# Altium schematic sheet 7_FPGA_Power_Supply.SchDoc
size A4; Organization: SpaceLab UFSC; Address1: UFSC - SpaceLab; Address2: University Campus - Trindade; Address3: Dep. of Electrical Engineering - CTC; Address4: Florianópolis, Santa Catarina, Brazil; Address5: CEP: 88040 - 900
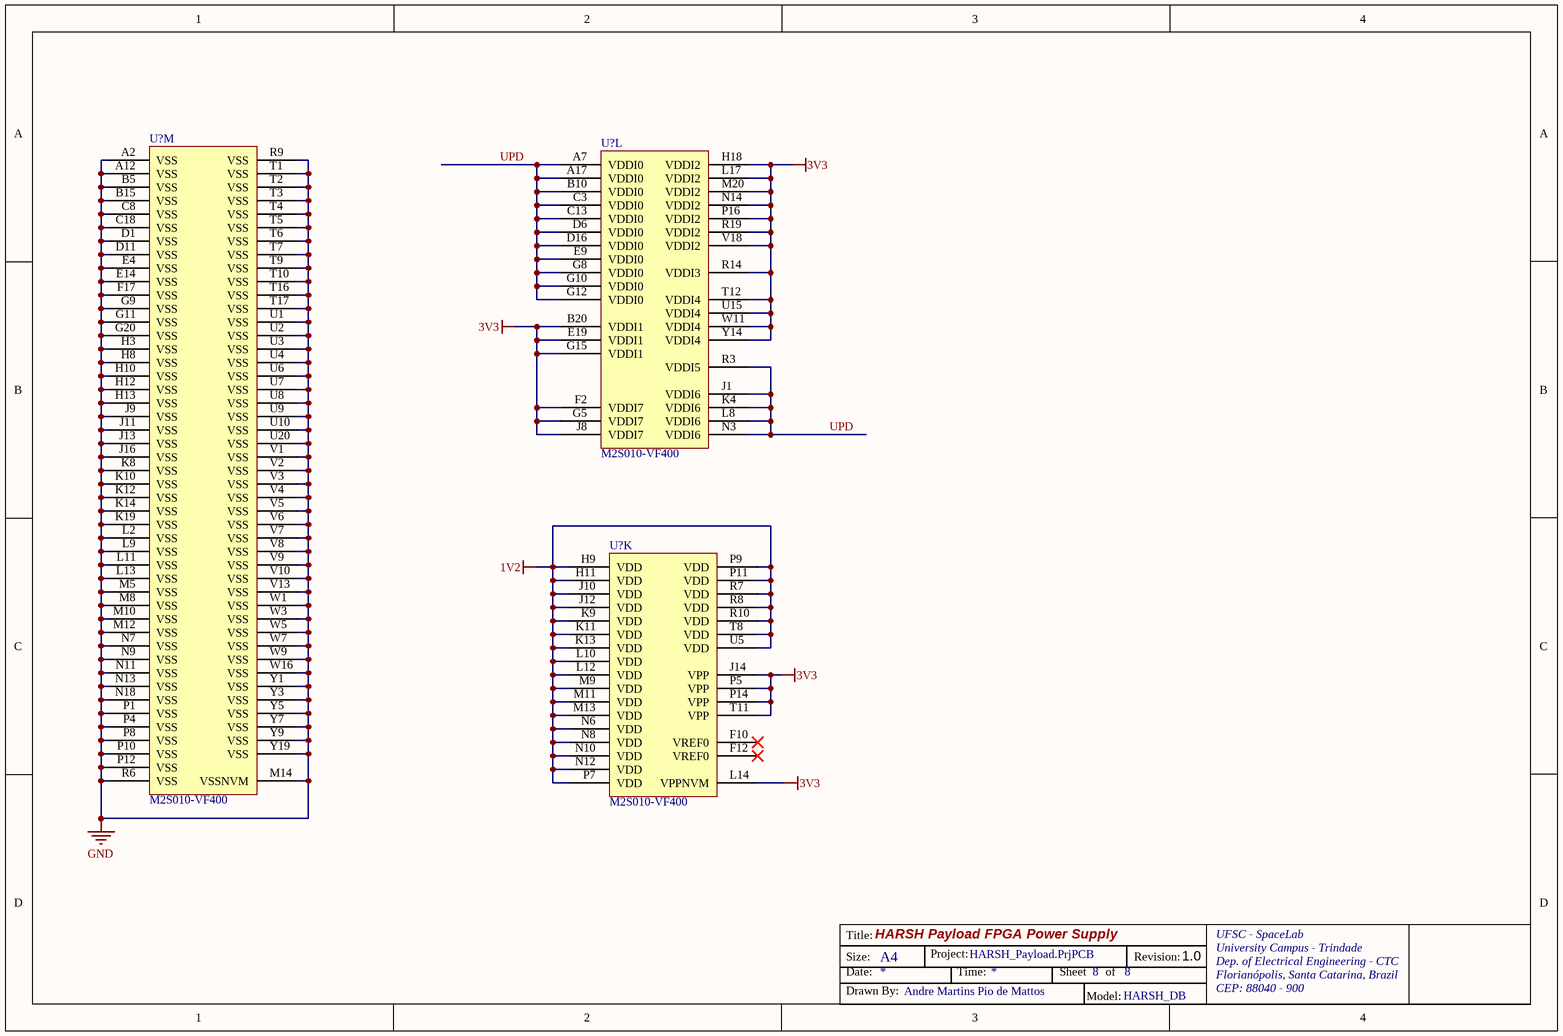
[diagram p0: 7_FPGA_Power_Supply.SchDoc]

## Parts
(Parts that share a designator on the sheet are numbered #1, #2 ... from top to bottom, then left to right.)
U?#1  M2S010-VF400  [MCSM-VF-400]  (part M of 14)
U?#2  M2S010-VF400  [MCSM-VF-400]  (part L of 14)
U?#3  M2S010-VF400  [MCSM-VF-400]  (part K of 14)

## Nets
1V2: U?#3.H9(VDD) U?#3.H11(VDD) U?#3.J10(VDD) U?#3.J12(VDD) U?#3.K9(VDD) U?#3.K11(VDD) U?#3.K13(VDD) U?#3.L10(VDD) U?#3.L12(VDD) U?#3.M9(VDD) U?#3.M11(VDD) U?#3.M13(VDD) U?#3.N6(VDD) U?#3.N8(VDD) U?#3.N10(VDD) U?#3.N12(VDD) U?#3.P7(VDD) U?#3.P9(VDD) U?#3.P11(VDD) U?#3.R7(VDD) U?#3.R8(VDD) U?#3.R10(VDD) U?#3.T8(VDD) U?#3.U5(VDD)
3V3: U?#2.B20(VDDI1) U?#2.E19(VDDI1) U?#2.F2(VDDI7) U?#2.G5(VDDI7) U?#2.G15(VDDI1) U?#2.H18(VDDI2) U?#2.J8(VDDI7) U?#2.L17(VDDI2) U?#2.M20(VDDI2) U?#2.N14(VDDI2) U?#2.P16(VDDI2) U?#2.R14(VDDI3) U?#2.R19(VDDI2) U?#2.T12(VDDI4) U?#2.U15(VDDI4) U?#2.V18(VDDI2) U?#2.W11(VDDI4) U?#2.Y14(VDDI4) U?#3.J14(VPP) U?#3.L14(VPPNVM) U?#3.P5(VPP) U?#3.P14(VPP) U?#3.T11(VPP)
GND: U?#1.A2(VSS) U?#1.A12(VSS) U?#1.B5(VSS) U?#1.B15(VSS) U?#1.C8(VSS) U?#1.C18(VSS) U?#1.D1(VSS) U?#1.D11(VSS) U?#1.E4(VSS) U?#1.E14(VSS) U?#1.F17(VSS) U?#1.G9(VSS) U?#1.G11(VSS) U?#1.G20(VSS) U?#1.H3(VSS) U?#1.H8(VSS) U?#1.H10(VSS) U?#1.H12(VSS) U?#1.H13(VSS) U?#1.J9(VSS) U?#1.J11(VSS) U?#1.J13(VSS) U?#1.J16(VSS) U?#1.K8(VSS) U?#1.K10(VSS) U?#1.K12(VSS) U?#1.K14(VSS) U?#1.K19(VSS) U?#1.L2(VSS) U?#1.L9(VSS) U?#1.L11(VSS) U?#1.L13(VSS) U?#1.M5(VSS) U?#1.M8(VSS) U?#1.M10(VSS) U?#1.M12(VSS) U?#1.M14(VSSNVM) U?#1.N7(VSS) U?#1.N9(VSS) U?#1.N11(VSS) U?#1.N13(VSS) U?#1.N18(VSS) U?#1.P1(VSS) U?#1.P4(VSS) U?#1.P8(VSS) U?#1.P10(VSS) U?#1.P12(VSS) U?#1.R6(VSS) U?#1.R9(VSS) U?#1.T1(VSS) U?#1.T2(VSS) U?#1.T3(VSS) U?#1.T4(VSS) U?#1.T5(VSS) U?#1.T6(VSS) U?#1.T7(VSS) U?#1.T9(VSS) U?#1.T10(VSS) U?#1.T16(VSS) U?#1.T17(VSS) U?#1.U1(VSS) U?#1.U2(VSS) U?#1.U3(VSS) U?#1.U4(VSS) U?#1.U6(VSS) U?#1.U7(VSS) U?#1.U8(VSS) U?#1.U9(VSS) U?#1.U10(VSS) U?#1.U20(VSS) U?#1.V1(VSS) U?#1.V2(VSS) U?#1.V3(VSS) U?#1.V4(VSS) U?#1.V5(VSS) U?#1.V6(VSS) U?#1.V7(VSS) U?#1.V8(VSS) U?#1.V9(VSS) U?#1.V10(VSS) U?#1.V13(VSS) U?#1.W1(VSS) U?#1.W3(VSS) U?#1.W5(VSS) U?#1.W7(VSS) U?#1.W9(VSS) U?#1.W16(VSS) U?#1.Y1(VSS) U?#1.Y3(VSS) U?#1.Y5(VSS) U?#1.Y7(VSS) U?#1.Y9(VSS) U?#1.Y19(VSS)
UPD: U?#2.A7(VDDI0) U?#2.A17(VDDI0) U?#2.B10(VDDI0) U?#2.C3(VDDI0) U?#2.C13(VDDI0) U?#2.D6(VDDI0) U?#2.D16(VDDI0) U?#2.E9(VDDI0) U?#2.G8(VDDI0) U?#2.G10(VDDI0) U?#2.G12(VDDI0) U?#2.J1(VDDI6) U?#2.K4(VDDI6) U?#2.L8(VDDI6) U?#2.N3(VDDI6) U?#2.R3(VDDI5)

Not connected (* = marked no-connect by the designer): U?#3 F10(VREF0)* F12(VREF0)*

## Notes on the sheet
- HARSH Payload FPGA Power Supply
- HARSH_Payload.PrjPCB
- 8
- 1.0
- Andre Martins Pio de Mattos
- HARSH_DB
- Title:
- Size:
- Date:
- A4
- Project:
- Time:
- Sheet
- of
- Revision:
- UFSC - SpaceLab
- University Campus - Trindade
- Dep. of Electrical Engineering - CTC
- Florianópolis, Santa Catarina, Brazil
- CEP: 88040 - 900
- Drawn By:
- Model:

## Library data of the parts
U?#1-U?#3 = M2S010-VF400: SmartFusion2 SoC FPGA, ARM Cortex-M3, 10 K LUTs, 195 User I/O, Design Security, 0 to 85 degC, 400-Ball BGA; Manufacturer: Microsemi; DDR Controllers (Count x Width): 1x18; MSIO (3.3V): 99; PLLs and CCCs: 2; eSRAM (K Bytes) Non SECDED: 80; SERDES Lanes: 4; Total User I/O: 195; eSRAM (K Bytes): 64; uSRAM1K Blocks: 22; Maximum Logic Elements: 12,084; MSIOD (2.5V): 32; eNVM (K Bytes): 256; Total RAM (K bits): 400; LSRAM 18K Blocks: 21; PartNumber: M2S010-VF400; PackageVersion: Rev. 48, 11/2013; ComponentLink1Description: Manufacturer URL; ComponentLink2Description: Datasheet; DatasheetVersion: Rev. 5; ComponentLink3URL: http://www.microsemi.com/document-portal/doc_download/131095-package-mechanical-drawings; ComponentLink1URL: http://www.microsemi.com/; ComponentLink2URL: http://www.microsemi.com/document-portal/doc_download/130717-smartfusion2-datasheet; PackageReference: VF-400; ComponentLink3Description: Package Specification; Math Blocks (18x18): 22; RoHS: FALSE; DDRIO (2.5V): 64; Mounting Technology: Surface Mount; PackageDescription: 400-Ball Very Fine Pitch Ball Grid Array, Body 17 x 17 mm, Pitch 0.8 mm